# Altium schematic sheet Cpcis_connectors_P1_P6.SchDoc: CPCIS Backplane
size 420 x 297 mm; CheckedBy: A.Paixao; CompanyName: CERN; DrawnBy: G. Daniluk; Engineer: G. Daniluk; Organization: CERN; Address1: European Organization for Nuclear Research; Address2: CH-1211 Genève 23 - Switzerland; DocumentNumber: 18; SheetNumber: 18; SheetTotal: 19; Title2: P1 to P4; DivGrp: BE/CO; Designer: G. Daniluk; EDA_Number: EDA-03828-V1-0; Projet: DIOT Demonstrator System Board (based on C-GEFE v1); ModifiedBy: G. Daniluk; CheckedDate: 18/06/2018; ProjectName: Distributed I/O Tier
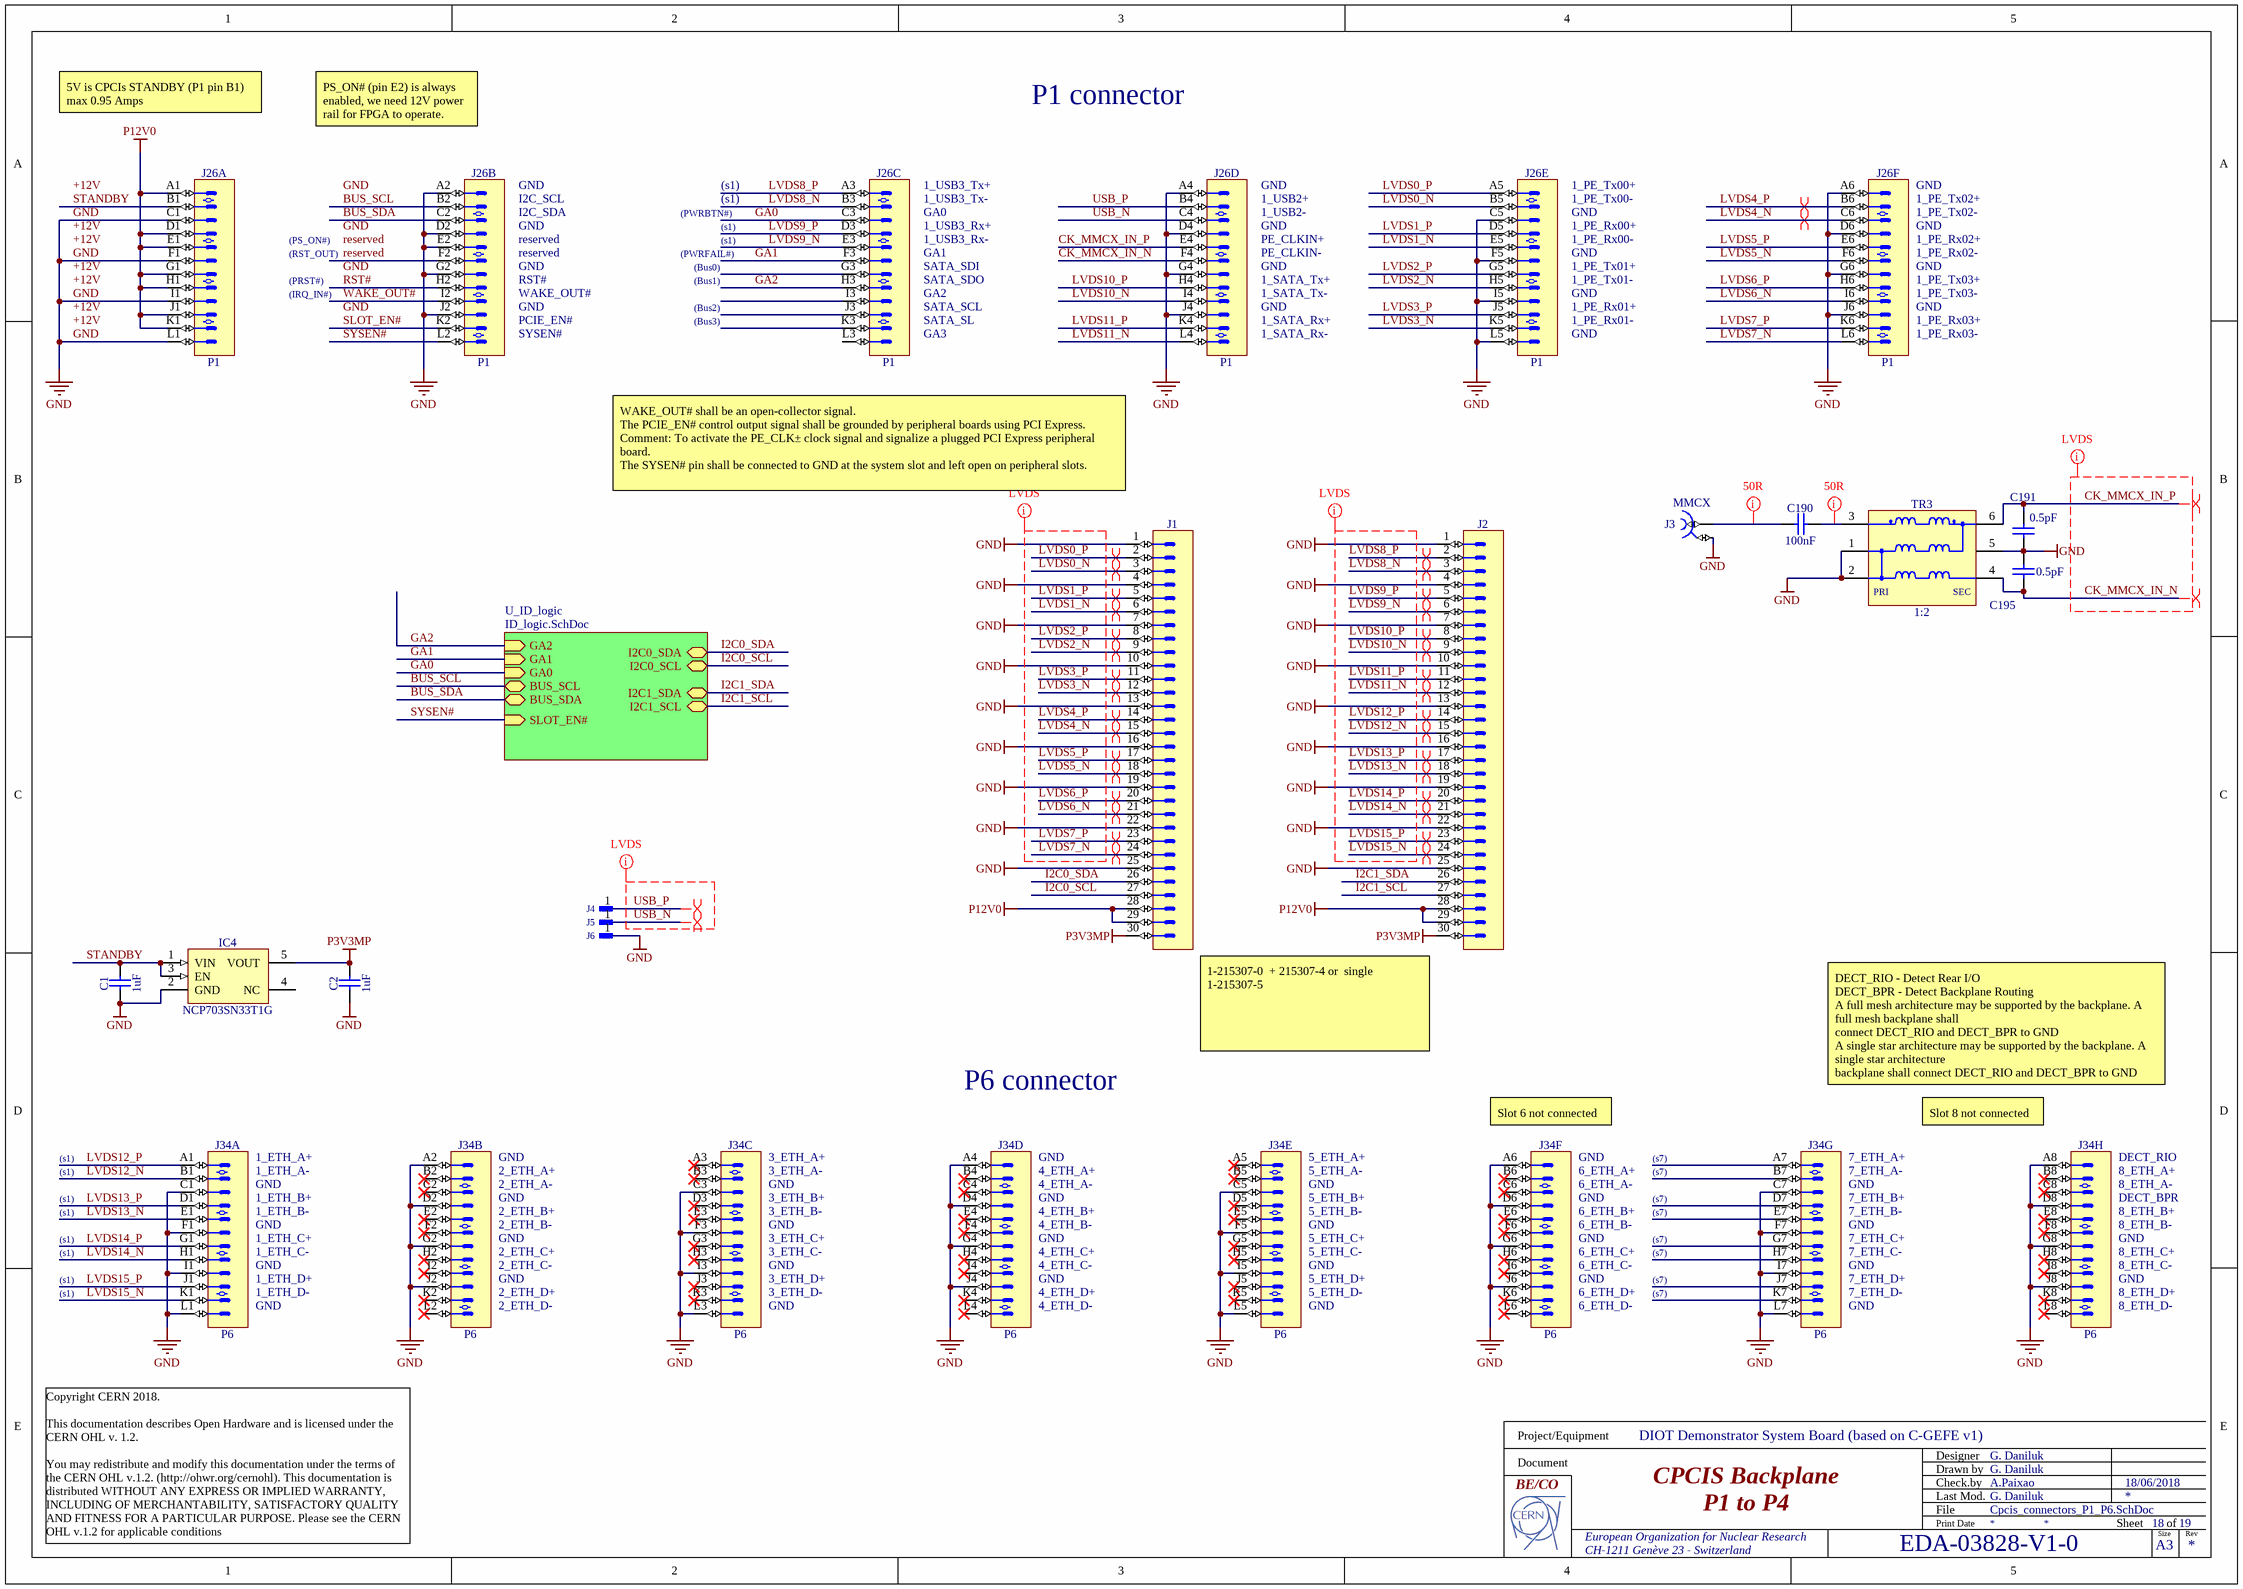
[diagram p0: Cpcis_connectors_P1_P6.SchDoc]

## Parts
C1  1uF  [CAPC2012X140N]
C2  1uF  [CAPC2012X140N]
C190  100nF  [CAPC1005X55N]
C191  0.5pF  [CAPC1005X50N]
C195  0.5pF  [CAPC1005X50N]
IC4  NCP703SN33T1G  [SOT95P275X110-5N]
J1  AMPMODU  [TYCO_1-215307-5]  (value not drawn)
J2  AMPMODU  [TYCO_1-215307-5]  (value not drawn)
J3  Family: MMCX  [HUBER-SUHNER_85_MMCX-50-0-1/111_OE]  (hidden comment: Coax_1Female_1Shield)
J4  SMD Pad  [R700X200]  (value not drawn)
J5  SMD Pad  [R700X200]  (value not drawn)
J6  SMD Pad  [R700X200]  (value not drawn)
J26  P1  [AMPHENOL_10052825-101LF]  (parts A,B,C,D,E,F of 6)
J34  P6  [AMPHENOL_10052838-101LF]  (parts A,B,C,D,E,F,G,H of 8)
TR3  1:2  [XFMR_MINI-CIRCUITS_DB1627]

## Sub-sheets
U_ID_logic = ID_logic.SchDoc: GA2 (in), GA1 (in), GA0 (in), BUS_SCL (bidir), BUS_SDA (bidir), SLOT_EN# (in), I2C0_SDA (bidir), I2C0_SCL (bidir), I2C1_SDA (bidir), I2C1_SCL (bidir)

## Nets
GND: C1.1 C2.1 C191.1 C195.2 IC4.2(GND) J1.1 J1.4 J1.7 J1.10 J1.13 J1.16 J1.19 J1.22 J1.25 J2.1 J2.4 J2.7 J2.10 J2.13 J2.16 J2.19 J2.22 J2.25 J3.2 J6.1 J26.A2 J26.A4 J26.A6 J26.C1 J26.C5 J26.D2 J26.D4 J26.D6 J26.E2 J26.F1 J26.F5 J26.G2 J26.G4 J26.G6 J26.I1 J26.I5 J26.J2 J26.J4 J26.J6 J26.L1 J26.L5 J34.A2 J34.A4 J34.A6 J34.A8 J34.C1 J34.C3 J34.C5 J34.C7 J34.D2 J34.D4 J34.D6 J34.D8 J34.F1 J34.F3 J34.F5 J34.F7 J34.G2 J34.G4 J34.G6 J34.G8 J34.I1 J34.I3 J34.I5 J34.I7 J34.J2 J34.J4 J34.J6 J34.J8 J34.L1 J34.L3 J34.L5 J34.L7 TR3.1(P1) TR3.2(P1) TR3.5(NC)
P3V3MP: C2.2 IC4.5(VOUT) J1.30 J2.30
P12V0: J1.28 J1.29 J2.28 J2.29 J26.A1 J26.D1 J26.E1 J26.G1 J26.H1 J26.J1 J26.K1
BUS_SCL: J26.B2 ; sheet U_ID_logic/BUS_SCL
BUS_SDA: J26.C2 ; sheet U_ID_logic/BUS_SDA
CK_MMCX_IN_N: C195.1 J26.F4 TR3.4(S1)
CK_MMCX_IN_P: C191.2 J26.E4 TR3.6(S1)
GA0: J26.C3 ; sheet U_ID_logic/GA0
GA1: J26.F3 ; sheet U_ID_logic/GA1
GA2: J26.H3 ; sheet U_ID_logic/GA2
I2C0_SCL: J1.27 ; sheet U_ID_logic/I2C0_SCL
I2C0_SDA: J1.26 ; sheet U_ID_logic/I2C0_SDA
I2C1_SCL: J2.27 ; sheet U_ID_logic/I2C1_SCL
I2C1_SDA: J2.26 ; sheet U_ID_logic/I2C1_SDA
LVDS0_N: J1.3 J26.B5
LVDS0_P: J1.2 J26.A5
LVDS1_N: J1.6 J26.E5
LVDS1_P: J1.5 J26.D5
LVDS2_N: J1.9 J26.H5
LVDS2_P: J1.8 J26.G5
LVDS3_N: J1.12 J26.K5
LVDS3_P: J1.11 J26.J5
LVDS4_N: J1.15 J26.C6
LVDS4_P: J1.14 J26.B6
LVDS5_N: J1.18 J26.F6
LVDS5_P: J1.17 J26.E6
LVDS6_N: J1.21 J26.I6
LVDS6_P: J1.20 J26.H6
LVDS7_N: J1.24 J26.L6
LVDS7_P: J1.23 J26.K6
LVDS8_N: J2.3 J26.B3
LVDS8_P: J2.2 J26.A3
LVDS9_N: J2.6 J26.E3
LVDS9_P: J2.5 J26.D3
LVDS10_N: J2.9 J26.I4
LVDS10_P: J2.8 J26.H4
LVDS11_N: J2.12 J26.L4
LVDS11_P: J2.11 J26.K4
LVDS12_N: J2.15 J34.B1
LVDS12_P: J2.14 J34.A1
LVDS13_N: J2.18 J34.E1
LVDS13_P: J2.17 J34.D1
LVDS14_N: J2.21 J34.H1
LVDS14_P: J2.20 J34.G1
LVDS15_N: J2.24 J34.K1
LVDS15_P: J2.23 J34.J1
reserved: J26.F2
RST#: J26.H2
SLOT_EN#: J26.K2
STANDBY: C1.2 IC4.1(VIN) IC4.3(EN) J26.B1
SYSEN#: J26.L2 ; sheet U_ID_logic/SLOT_EN#
USB_N: J5.1 J26.C4
USB_P: J4.1 J26.B4
WAKE_OUT#: J26.I2
NetC190_1: C190.1 J3.1
NetC190_2: C190.2 TR3.3(P1)

Not connected (* = marked no-connect by the designer): IC4 4(NC); J26 G3 I3 J3 K3 L3; J34 A3* A5* A7 B2* B3* B4* B5* B6* B7 B8* C2* C4* C6* C8* D3* D5* D7 E2* E3* E4* E5* E6* E7 E8* F2* F4* F6* F8* G3* G5* G7 H2* H3* H4* H5* H6* H7 H8* I2* I4* I6* I8* J3* J5* J7 K2* K3* K4* K5* K6* K7 K8* L2* L4* L6* L8*

## Layout directives
differential pair: CK_MMCX_IN_N, CK_MMCX_IN_P, LVDS0_N, LVDS0_P, LVDS1_N, LVDS1_P, LVDS2_N, LVDS2_P, LVDS3_N, LVDS3_P, LVDS4_N, LVDS4_P, LVDS5_N, LVDS5_P, LVDS6_N, LVDS6_P, LVDS7_N, LVDS7_P, LVDS8_N, LVDS8_P, LVDS9_N, LVDS9_P, LVDS10_N, LVDS10_P, LVDS11_N, LVDS11_P, LVDS12_N, LVDS12_P, LVDS13_N, LVDS13_P, LVDS14_N, LVDS14_P, LVDS15_N, LVDS15_P, USB_N, USB_P
net class LVDS: CK_MMCX_IN_N, CK_MMCX_IN_P, LVDS0_N, LVDS0_P, LVDS1_N, LVDS1_P, LVDS2_N, LVDS2_P, LVDS3_N, LVDS3_P, LVDS4_N, LVDS4_P, LVDS5_N, LVDS5_P, LVDS6_N, LVDS6_P, LVDS7_N, LVDS7_P, LVDS8_N, LVDS8_P, LVDS9_N, LVDS9_P, LVDS10_N, LVDS10_P, LVDS11_N, LVDS11_P, LVDS12_N, LVDS12_P, LVDS13_N, LVDS13_P, LVDS14_N, LVDS14_P, LVDS15_N, LVDS15_P, USB_N, USB_P
rule Width Constraint [Pref Impedance = 50,00ohms    Min Impedance = 50,00ohms    Max Impedance = 50,00ohms]: NetC190_1, NetC190_2

## Notes on the sheet
- 5V is CPCIs STANDBY (P1 pin B1)
  max 0.95 Amps
- PS_ON# (pin E2) is always enabled, we need 12V power rail for FPGA to operate.
- P1 connector
- GND
- (s1)
- 1_USB3_Tx+
- 1_PE_Tx00+
- (near J26) GND
- (RST_OUT)
- (PS_ON#)
- I2C_SCL
- I2C_SDA
- reserved
- (PWRBTN#)
- (PWRFAIL#)
- 1_USB3_Tx-
- GA0
- 1_USB3_Rx+
- 1_USB3_Rx-
- GA1
- 1_USB2+
- 1_USB2-
- PE_CLKIN+
- PE_CLKIN-
- 1_PE_Tx00-
- 1_PE_Rx00+
- 1_PE_Rx00-
- (near J26) 1_PE_Tx02+
- (near J26) 1_PE_Tx02-
- (near J26) 1_PE_Rx02+
- (near J26) 1_PE_Rx02-
- (PRST#)
- (IRQ_IN#)
- RST#
- WAKE_OUT#
- PCIE_EN#
- (Bus0)
- (Bus1)
- (Bus2)
- (Bus3)
- SATA_SDI
- SATA_SDO
- GA2
- SATA_SCL
- SATA_SL
- 1_SATA_Tx+
- 1_SATA_Tx-
- 1_SATA_Rx+
- 1_PE_Tx01+
- 1_PE_Tx01-
- 1_PE_Rx01+
- 1_PE_Rx01-
- (near J26) 1_PE_Tx03+
- (near J26) 1_PE_Tx03-
- (near J26) 1_PE_Rx03+
- SYSEN#
- GA3
- 1_SATA_Rx-
- (near J26) 1_PE_Rx03-
- WAKE_OUT# shall be an open-collector signal.
  The PCIE_EN# control output signal shall be grounded by peripheral boards using PCI Express.
  Comment: To activate the PE_CLK± clock signal and signalize a plugged PCI Express peripheral board.
  The SYSEN# pin shall be connected to GND at the system slot and left open on peripheral slots.
- 1-215307-0  + 215307-4 or  single 1-215307-5
- P6 connector
- (near J34) Slot 6 not connected
- DECT_RIO - Detect Rear I/O
  DECT_BPR - Detect Backplane Routing
  A full mesh architecture may be supported by the backplane. A full mesh backplane shall
  connect DECT_RIO and DECT_BPR to GND
  A single star architecture may be supported by the backplane. A single star architecture
  backplane shall connect DECT_RIO and DECT_BPR to GND
- (near J34) Slot 8 not connected
- (near J34) 1_ETH_A+
- (near J34) 1_ETH_A-
- (near J34) GND
- (near J34) 1_ETH_B+
- (near J34) 2_ETH_A+
- (near J34) 2_ETH_A-
- (near J34) 3_ETH_A+
- (near J34) 3_ETH_A-
- (near J34) 3_ETH_B+
- (near J34) 4_ETH_A+
- (near J34) 4_ETH_A-
- (near J34) 5_ETH_A+
- (near J34) 5_ETH_A-
- (near J34) 5_ETH_B+
- (near J34) 6_ETH_A+
- (near J34) 6_ETH_A-
- (s7)
- (near J34) 7_ETH_A+
- (near J34) 7_ETH_A-
- (near J34) 7_ETH_B+
- (near J34) DECT_RIO
- (near J34) 8_ETH_A+
- (near J34) 8_ETH_A-
- (near J34) DECT_BPR
- (near J34) 1_ETH_B-
- (near J34) 1_ETH_C+
- (near J34) 1_ETH_C-
- (near J34) 2_ETH_B+
- (near J34) 2_ETH_B-
- (near J34) 2_ETH_C+
- (near J34) 2_ETH_C-
- (near J34) 3_ETH_B-
- (near J34) 3_ETH_C+
- (near J34) 3_ETH_C-
- (near J34) 4_ETH_B+
- (near J34) 4_ETH_B-
- (near J34) 4_ETH_C+
- (near J34) 4_ETH_C-
- (near J34) 5_ETH_B-
- (near J34) 5_ETH_C+
- (near J34) 5_ETH_C-
- (near J34) 6_ETH_B+
- (near J34) 6_ETH_B-
- (near J34) 6_ETH_C+
- (near J34) 6_ETH_C-
- (near J34) 7_ETH_B-
- (near J34) 7_ETH_C+
- (near J34) 7_ETH_C-
- (near J34) 8_ETH_B+
- (near J34) 8_ETH_B-
- (near J34) 8_ETH_C+
- (near J34) 8_ETH_C-
- (near J34) 1_ETH_D+
- (near J34) 1_ETH_D-
- (near J34) 2_ETH_D+
- (near J34) 2_ETH_D-
- (near J34) 3_ETH_D+
- (near J34) 3_ETH_D-
- (near J34) 4_ETH_D+
- (near J34) 4_ETH_D-
- (near J34) 5_ETH_D+
- (near J34) 5_ETH_D-
- (near J34) 6_ETH_D+
- (near J34) 6_ETH_D-
- (near J34) 7_ETH_D+
- (near J34) 7_ETH_D-
- (near J34) 8_ETH_D+
- (near J34) 8_ETH_D-
- Copyright CERN 2018.
  This documentation describes Open Hardware and is licensed under the CERN OHL v. 1.2.
  You may redistribute and modify this documentation under the terms of the CERN OHL v.1.2. (http://ohwr.org/cernohl). This documentation is distributed WITHOUT ANY EXPRESS OR IMPLIED WARRANTY, INCLUDING OF MERCHANTABILITY, SATISFACTORY QUALITY AND FITNESS FOR A PARTICULAR PURPOSE. Please see the CERN OHL v.1.2 for applicable conditions
- Labels drawn without touching a wire or pin: +12V, GND, reserved
- Project/Equipment
- Document
- Designer
- Drawn by
- Check.by
- File
- Last Mod.
- Print Date
- Sheet
- Size
- A3
- of
- Rev
- (in symbol XFMR_MINI-CIRCUITS_TCM2-43X+) PRI; SEC

## Library data of the parts
C1 C2 = CC0805_1UF_35V_20%_X7R: Non-polarised capacitor; Part Description: SMD Multilayer Chip Ceramic Capacitor; Manufacturer: GENERIC; Manufacturer1 Part Number: GMK212B7105MG-T; Voltage: 35V; TC: X7R; Tolerance: ±20%; Part Number: CC0805_1UF_35V_20%_X7R; Component Kind: Standard; Component Type: Standard; Pin Count: 2; Value: 1uF; Status: Not Recommended; Manufacturer Part Number: CC0805_1UF_35V_20%_X7R; Case: 0805; Mounted: Yes; Socket: No; SMD: Yes; Sense: No; Manufacturer1 Example: TAIYO YUDEN; Manufacturer1 ComponentHeight: 1.35mm; HelpURL: \\cern.ch\dfs\Applications\Altium\Datasheets\CC0805_X7R_TAIYO-YUDEN_HIGH-VALUE.pdf; Author: CERN DEM JLC; CreateDate: 22.06.2011; LatestRevisionDate: 22.06.2011
C190 = CC0402_100NF_16V_10%_X5R: Non-polarised capacitor; Part Description: SMD Multilayer Chip Ceramic Capacitor; Manufacturer: GENERIC; Manufacturer1 Part Number: GRM155R61C104KA88D; Voltage: 16V; TC: X5R; Tolerance: ±10%; Part Number: CC0402_100NF_16V_10%_X5R; Component Kind: Standard; Component Type: Standard; Pin Count: 2; Value: 100nF; Status: None; Manufacturer Part Number: CC0402_100NF_16V_10%_X5R; Case: 0402; Mounted: Yes; Socket: No; SMD: Yes; Sense: No; Manufacturer1 Example: MURATA; Manufacturer1 ComponentHeight: 0.55mm; HelpURL: \\cern.ch\dfs\Applications\Altium\Datasheets\CC0402_X5R_MURATA_GRM.pdf; Author: CERN DEM JLC; CreateDate: 10.12.2013; LatestRevisionDate: 10.12.2013
C191 C195 = CC0402_0.5PF_25V_0.05PF_AVX_04023J0R5ABSTR: Non-polarised capacitor; Part Description: Thin-Film Chip Capacitors for RF Signal and Power Applications, Accu-P Series; Manufacturer: AVX; Voltage: 25V; Tolerance: ±0.05pF; Part Number: CC0402_0.5PF_25V_0.05PF_AVX_04023J0R5ABSTR; Component Kind: Standard; Component Type: Standard; Pin Count: 2; Value: 0.5pF; Status: None; Manufacturer Part Number: 04023J0R5ABSTR; Case: 0402; Mounted: Yes; Socket: No; SMD: Yes; Sense: No; ComponentHeight: 0.5mm; HelpURL: \\cern.ch\dfs\Applications\Altium\Datasheets\CC0402_AVX_ACCU-P.pdf; Author: CERN DEM JLC; CreateDate: 2017-02-22; LatestRevisionDate: 2017-02-22
IC4 = NCP703SN33T1G: 3.3V 300mA, Ultra-Low Quiescent Current, IQ 12uA, Ultra-Low Noise, LDO Voltage Regulator; Manufacturer: ON SEMICONDUCTOR; PressFit: No; Bonding: No; Part Number: NCP703SN33T1G; Component Kind: Standard; Component Type: Standard; Device: NCP703SN33T1G; PackageDescription: SOT, 0.95mm Pitch; 5 Pin, 1.50mm W X 3.00mm L X 1.10mm H Body, IPC Medium Density; Part Description: 3.3V 300mA, Ultra-Low Quiescent Current, IQ 12uA, Ultra-Low Noise, LDO Voltage Regulator; Manufacturer Part Number: NCP703SN33T1G; Pin Count: 5; Case: SOT23-5; Mounted: Yes; Socket: No; SMD: Yes; Sense: No; ComponentHeight: 1.1mm; HelpURL: \\cern.ch\dfs\Applications\Altium\Datasheets\NCP703SN33T1G.pdf; Author: CERN DEM JLC; CreateDate: 16.02.2017; LatestRevisionDate: 16.02.2017
J1 J2 = CON_2x15_2.54_female_V_mirror: Connector 2.54mm, 30 pin female, vertical, 7mm, AMPMODU HV-100/HV-190; Part Description: 34 Contacts, Dual Row Vertical Low Profile IDC Shrouded Header, with Long Eject Latch; Manufacturer: TYCO ELECTRONICS; Manufacturer Part Number: 1-215307-5; PressFit: No; Part Number: TYCO_1-215307-5; Component Kind: Standard; Component Type: Standard; Pin Count: 30; Family: AMPMODU; Mounted: Yes; Socket: No; SMD: No; Sense: No; Status: None; ComponentHeight: 22.86mm; HelpURL: \\cern.ch\dfs\Applications\Altium\Datasheets\TYCO_3-1761606-1.pdf; Author: GK; CreateDate: 05.10.2015; LatestRevisionDate: 05.10.2015
J3 = HUBER-SUHNER_85_MMCX-50-0-1/111_OE: Part Description: MMCX 50 Ohms Right Angle PCB Jack; Manufacturer: HUBER+SUHNER; PressFit: No; Part Number: HUBER-SUHNER_85_MMCX-50-0-1/111_OE; Component Kind: Standard; Component Type: Standard; Pin Count: 2; Mounted: Yes; Socket: No; SMD: No; Sense: No; Status: None; Manufacturer Part Number: 85_MMCX-50-0-1/111_OE; ComponentHeight: 9.6mm; HelpURL: \\cern.ch\dfs\Applications\Altium\Datasheets\HUBER-SUHNER_85_MMCX-50-0-1-111_OE.pdf; Author: CERN DEM JLC; CreateDate: 06.11.2014; LatestRevisionDate: 06.11.2014
J4-J6 = TEST1_CompoKind: Single SMD Pad Standard; Part Description: 7mm x 2mm SMD Pad; Mounted: No; Part Number: TEST1_CompoKind; Component Kind: Standard (No BOM); Component Type: Standard; Pin Count: 1; Family: SMD Pad; Socket: No; SMD: No; Sense: No; Status: None; ComponentHeight: 0mm; HelpURL: Undefined; Author: CERN DEM MR; CreateDate: 26.03.2019; LatestRevisionDate: 26.03.2019; PackageDescription: 7mm x  2mm SMD Pad
J26 = AMPHENOL_10052825-101LF: 72 Contacts Header, 6 Columns, 4 Pairs per Column; Part Description: 72 Contacts, 2mm Pitch, 6 Columns, 4 Pairs per Column, 4 Walls, Right Angle Header; Part Number: AMPHENOL_10052825-101LF; Component Kind: Standard; Component Type: Standard; Pin Count: 72; Family: AirMax VS; Mounted: Yes; Socket: No; SMD: No; PressFit: Yes; Sense: No; Status: None; Manufacturer: AMPHENOL; Manufacturer Part Number: 10052825-101LF; ComponentHeight: 15.35mm; HelpURL: \\cern.ch\dfs\Applications\Altium\Datasheets\AMPHENOL_10052825-101LF.pdf; ComponentLink1URL: \\cern.ch\dfs\Applications\Altium\Datasheets\AMPHENOL_10052825-101LF_Application.pdf; ComponentLink1Description: Application; Author: CERN DEM MR; CreateDate: 19/02/2018; LatestRevisionDate: 19/02/2018; Classname: Overlapping
J34 = AMPHENOL_10052838-101LF: 96 Contacts Header, 8 Columns, 4 Pairs per Column; Part Description: 96 Contacts, 2mm Pitch, 8 Columns, 4 Pairs per Column, 4 Walls, Right Angle Header; Part Number: AMPHENOL_10052838-101LF; Component Kind: Standard; Component Type: Standard; Pin Count: 96; Family: AirMax VS; Mounted: Yes; Socket: No; SMD: No; PressFit: Yes; Sense: No; Status: None; Manufacturer: AMPHENOL; Manufacturer Part Number: 10052838-101LF; ComponentHeight: 15.35mm; HelpURL: \\cern.ch\dfs\Applications\Altium\Datasheets\AMPHENOL_10052838-101LF.pdf; ComponentLink1URL: \\cern.ch\dfs\Applications\Altium\Datasheets\AMPHENOL_10052838-101LF_Application.pdf; ComponentLink1Description: Application; Author: CERN DEM MR; CreateDate: 19/02/2018; LatestRevisionDate: 19/02/2018; Classname: Overlapping
TR3 = XFMR_MINI-CIRCUITS_TCM2-43X+: 50 OHMS 10 to 4000 MHz RF Transformer; Power: 0.4W; Part Number: XFMR_MINI-CIRCUITS_TCM2-43X+; Component Kind: Standard; Component Type: Standard; Pin Count: 6; Value: 1:2; Status: None; Part Description: 50 Ohms 10 to 4000MHz RF Transformer; Manufacturer: MINI-CIRCUITS; Manufacturer Part Number: TCM2-43X+; Mounted: Yes; Socket: No; Sense: No; SMD: Yes; ComponentHeight: 4.06mm; HelpURL: \\cern.ch\dfs\Applications\Altium\Datasheets\XFMR_MINI-CIRCUITS_TCM2-43X+.pdf; Author: CERN DEM BC; CreateDate: 2016-02-12; LatestRevisionDate: 2016-02-12